# EAGLE schematic ADE9153A_scamatic (EAGLE 9.6.2)
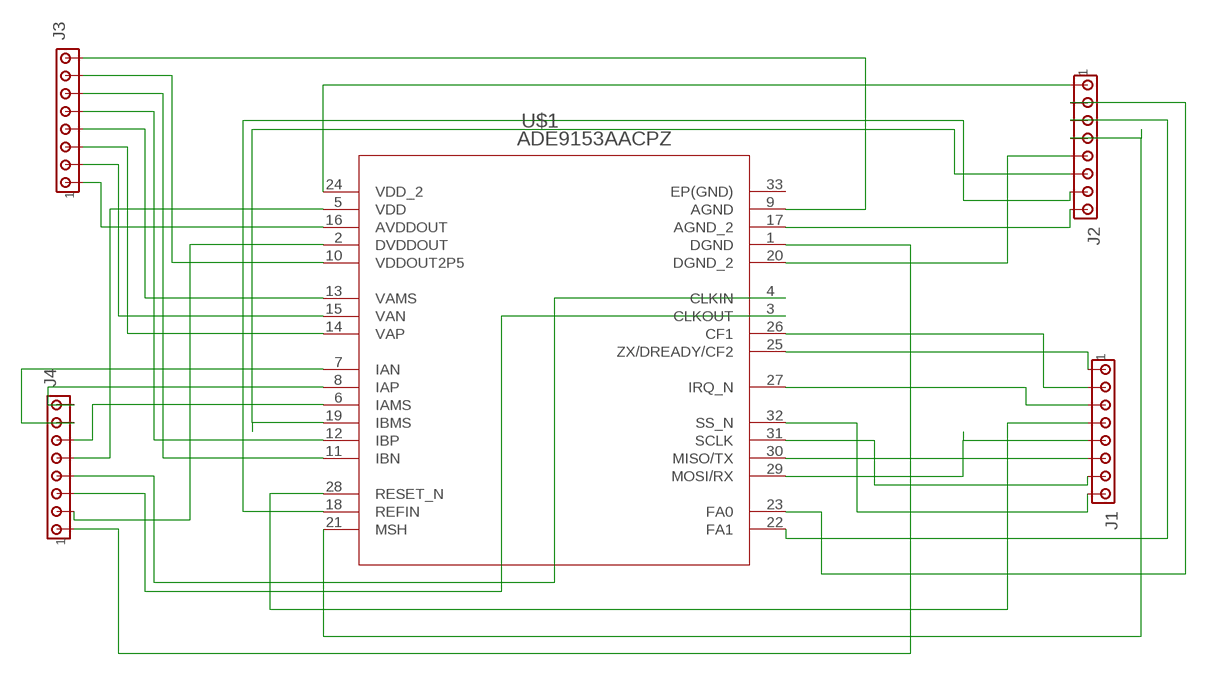
[diagram p0: schematic, sheet 1]

## Parts
J1  MTA08-100  [10X08MTA]
J2  MTA08-100  [10X08MTA]
J3  MTA08-100  [10X08MTA]
J4  MTA08-100  [10X08MTA]
U$1  ADE9153AACPZ  [QFN50P500X500X80-33N]

## Nets
N$1: J1.1 U$1.25(ZX/DREADY/CF2)
N$2: J1.2 U$1.26(CF1)
N$3: J1.3 U$1.27(IRQ_N)
N$4: J1.4 U$1.28(RESET_N)
N$5: J1.5 U$1.29(MOSI/RX)
N$6: J1.6 U$1.30(MISO/TX)
N$7: J1.7 U$1.31(SCLK)
N$8: J1.8 U$1.32(SS_N)
N$9: J2.8 U$1.17(AGND_2)
N$10: J2.7 U$1.18(REFIN)
N$11: J2.6 U$1.19(IBMS)
N$12: J2.5 U$1.20(DGND_2)
N$13: J2.4 U$1.21(MSH)
N$14: J2.3 U$1.22(FA1)
N$15: J2.2 U$1.23(FA0)
N$16: J2.1 U$1.24(VDD_2)
N$17: J3.8 U$1.9(AGND)
N$18: J3.7 U$1.10(VDDOUT2P5)
N$19: J3.6 U$1.11(IBN)
N$20: J3.5 U$1.12(IBP)
N$21: J3.4 U$1.13(VAMS)
N$22: J3.3 U$1.14(VAP)
N$23: J3.2 U$1.15(VAN)
N$24: J3.1 U$1.16(AVDDOUT)
N$25: J4.1 U$1.1(DGND)
N$26: J4.2 U$1.2(DVDDOUT)
N$27: J4.3 U$1.3(CLKOUT)
N$28: J4.4 U$1.4(CLKIN)
N$29: J4.5 U$1.5(VDD)
N$30: J4.6 U$1.6(IAMS)
N$31: J4.7 U$1.7(IAN)
N$32: J4.8 U$1.8(IAP)
Unconnected: U$1.33(EP(GND))

## Library data of the parts
J1-J4 = con-amp:MTA08-100: AMP connector
U$1 = ADE9153AACPZ:ADE9153AACPZ: Check availability <https://pricing.snapeda.com/parts/ADE9153AACPZ/Analog%20Devices/view-part?ref=eda>; AVAILABILITY: In Stock; DESCRIPTION: Energy Metering IC with Autocalibration; MF: Analog Devices; MP: ADE9153AACPZ; PACKAGE: LFCSP -32 Analog Devices; PRICE: None; PURCHASE-URL: https://pricing.snapeda.com/search/part/ADE9153AACPZ/?ref=eda